# EAGLE design avt-trigger-shield (EAGLE 8.7.0)
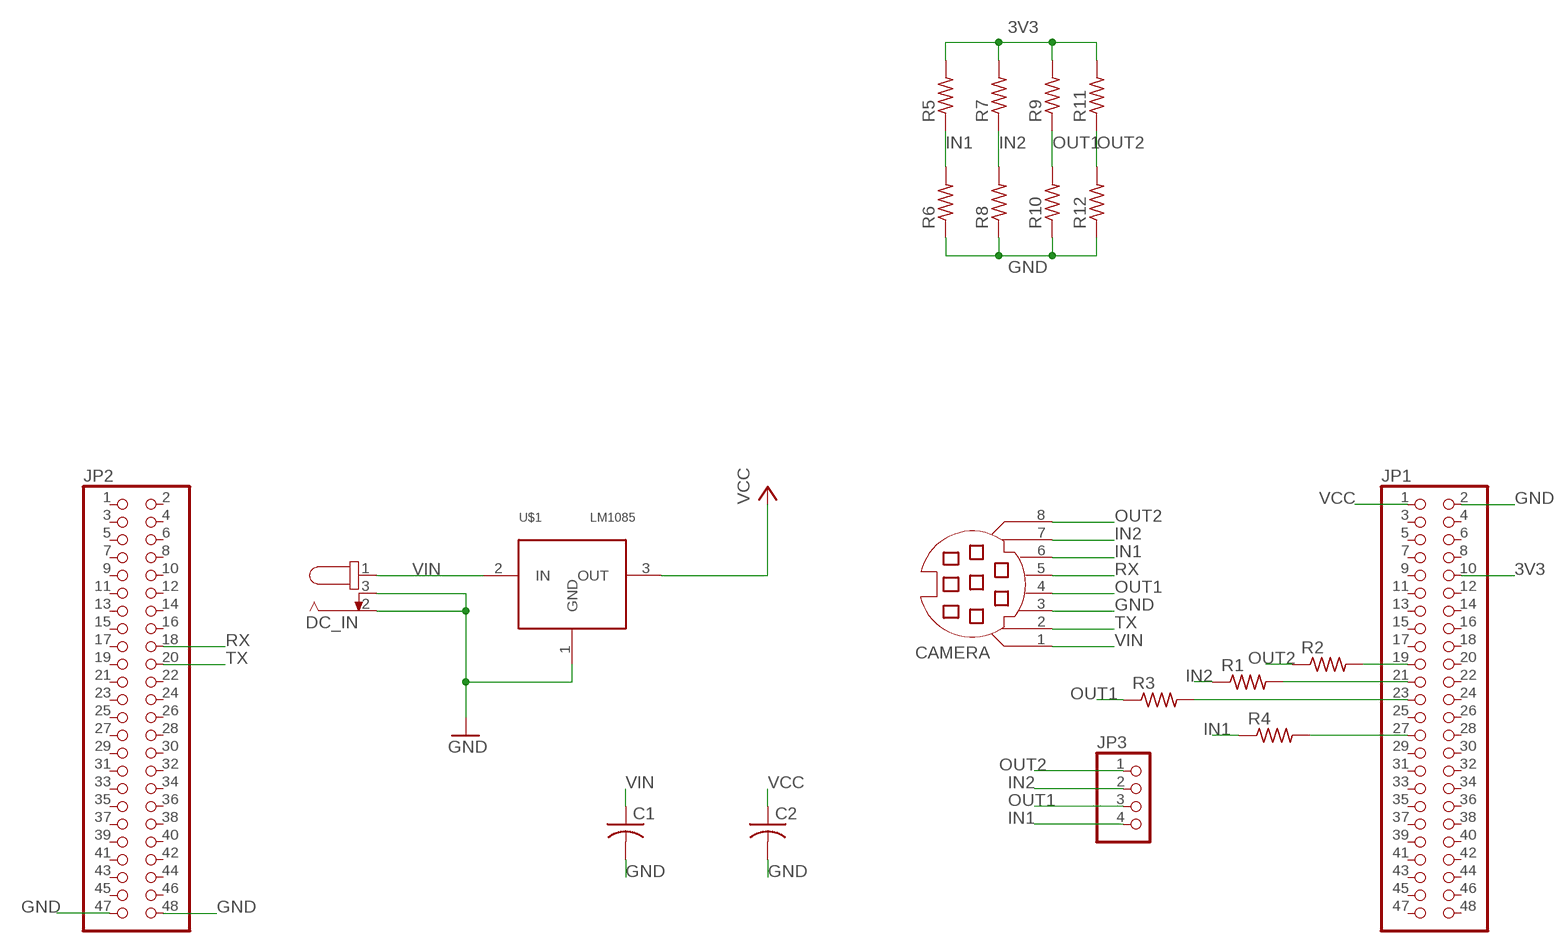
[diagram p0: schematic, sheet 1]

## Parts
C1  C-USC1206  [C1206]
C2  C-USC1206  [C1206]
CAMERA  MD08SS  [MDIN08SS]
DC_IN  694106105102  [694106105102]
JP1  PINHD-2X24  [2X24]
JP2  PINHD-2X24  [2X24]
JP3  PINHD-1X4  [1X04]
R1  R-US_R0603  [R0603]
R2  R-US_R0603  [R0603]
R3  R-US_R0603  [R0603]
R4  R-US_R0603  [R0603]
R5  R-US_R0603  [R0603]
R6  R-US_R0603  [R0603]
R7  R-US_R0603  [R0603]
R8  R-US_R0603  [R0603]
R9  R-US_R0603  [R0603]
R10  R-US_R0603  [R0603]
R11  R-US_R0603  [R0603]
R12  R-US_R0603  [R0603]
U$1  LM1085  [TO263]

## Nets
3V3: JP1.10 R5.2 R7.2 R9.2 R11.2
GND: C1.2 C2.2 CAMERA.3 DC_IN.2 DC_IN.3 JP1.2 JP2.47 JP2.48 R6.1 R8.1 R10.1 R12.1 U$1.1(GND)
IN1: CAMERA.6 JP3.4 R4.1 R5.1 R6.2
IN2: CAMERA.7 JP3.2 R1.1 R7.1 R8.2
N$1: JP1.21 R1.2
N$2: JP1.19 R2.2
N$3: JP1.23 R3.2
N$7: JP1.27 R4.2
OUT1: CAMERA.4 JP3.3 R3.1 R9.1 R10.2
OUT2: CAMERA.8 JP3.1 R2.1 R11.1 R12.2
RX: CAMERA.5 JP2.18
TX: CAMERA.2 JP2.20
VCC: C2.1 JP1.1 U$1.3(OUT)
VIN: C1.1 CAMERA.1 DC_IN.1 U$1.2(IN)
Unconnected: JP1.3 JP1.4 JP1.5 JP1.6 JP1.7 JP1.8 JP1.9 JP1.11 JP1.12 JP1.13 JP1.14 JP1.15 JP1.16 JP1.17 JP1.18 JP1.20 JP1.22 JP1.24 JP1.25 JP1.26 JP1.28 JP1.29 JP1.30 JP1.31 JP1.32 JP1.33 JP1.34 JP1.35 JP1.36 JP1.37 JP1.38 JP1.39 JP1.40 JP1.41 JP1.42 JP1.43 JP1.44 JP1.45 JP1.46 JP1.47 JP1.48 JP2.1 JP2.2 JP2.3 JP2.4 JP2.5 JP2.6 JP2.7 JP2.8 JP2.9 JP2.10 JP2.11 JP2.12 JP2.13 JP2.14 JP2.15 JP2.16 JP2.17 JP2.19 JP2.21 JP2.22 JP2.23 JP2.24 JP2.25 JP2.26 JP2.27 JP2.28 JP2.29 JP2.30 JP2.31 JP2.32 JP2.33 JP2.34 JP2.35 JP2.36 JP2.37 JP2.38 JP2.39 JP2.40 JP2.41 JP2.42 JP2.43 JP2.44 JP2.45 JP2.46

## Library data of the parts
C1 C2 = resistor:C-US: CAPACITOR, American symbol
CAMERA = con-yamaichi:MD08SS: YAMAICHI CONNECTOR; OC_FARNELL: unknown; OC_NEWARK: unknown
DC_IN = Wurth_Elektronik_Electromechanic_DC_Power_Jack_Connectors_rev15c:694106105102: WR-DC_DC Power Jack_Right Angled_SMT Center Pin Ø2.0_Plug ID Ø2.05_Plug OD Ø5.5_with Peg ;=>Code : Con_WR-DC_SMT_694106105102_694106105102 <http://katalog.we-online.de/media/images/eican/Con_WR-DC_SMT_694106105102_pf2.jpg> Details see: http://katalog.we-online.de/em/datasheet/6941xx105102.pdf Created 2014-10-08, Karrer Zheng 2014 (C) Wurth Elektronik
JP1 JP2 = pinhead:PINHD-2X24: PIN HEADER
JP3 = pinhead:PINHD-1X4: PIN HEADER
R1-R12 = rcl:R-US_: RESISTOR, American symbol; SPICEPREFIX: R
U$1 = custom-regs:LM1085

## Board
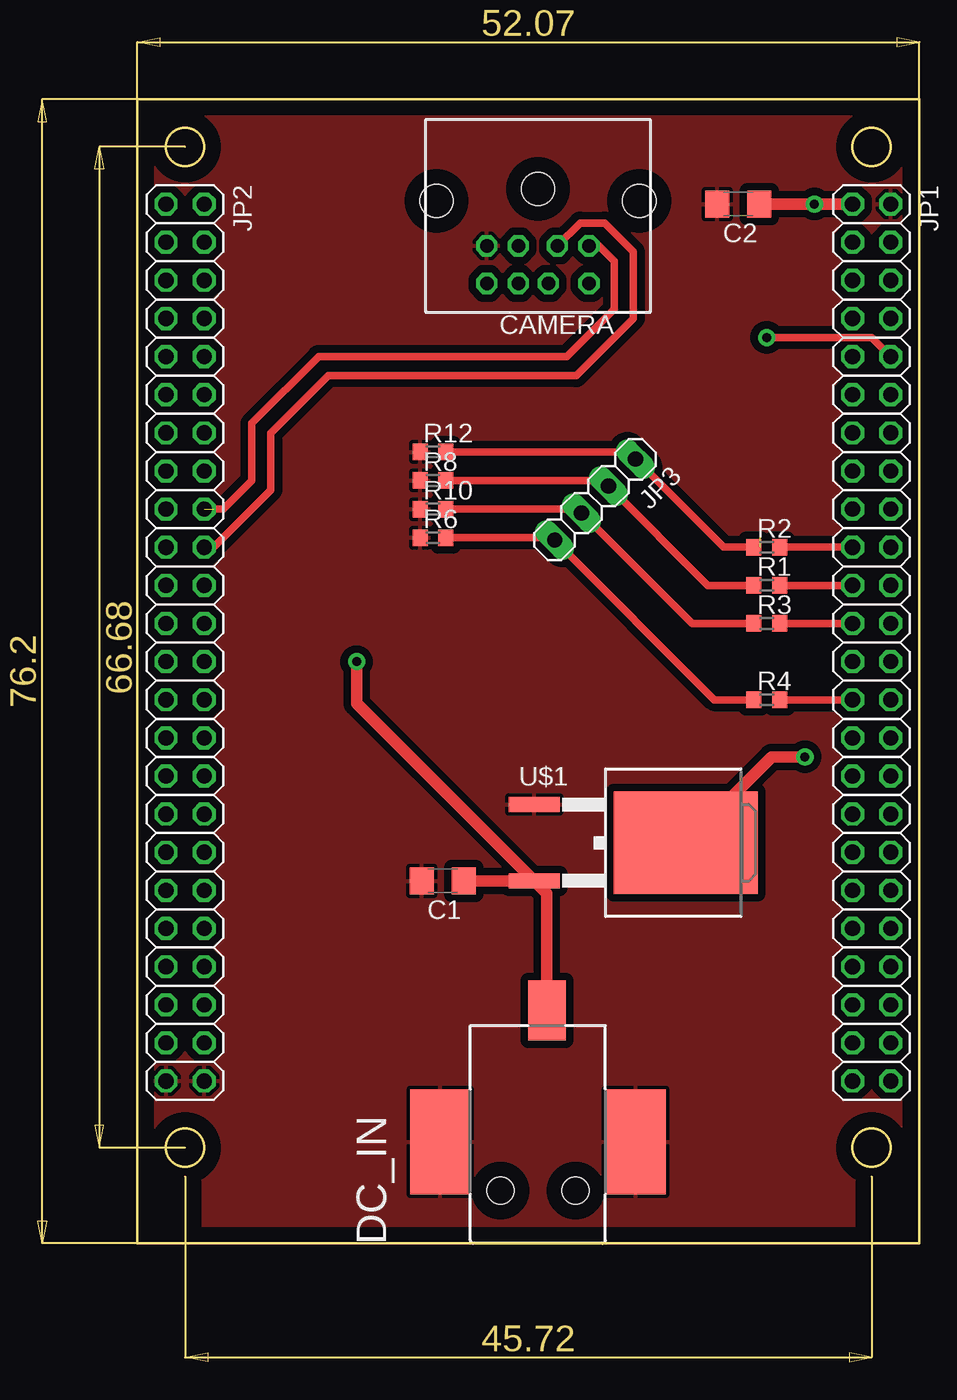
[diagram p1: board, top side]
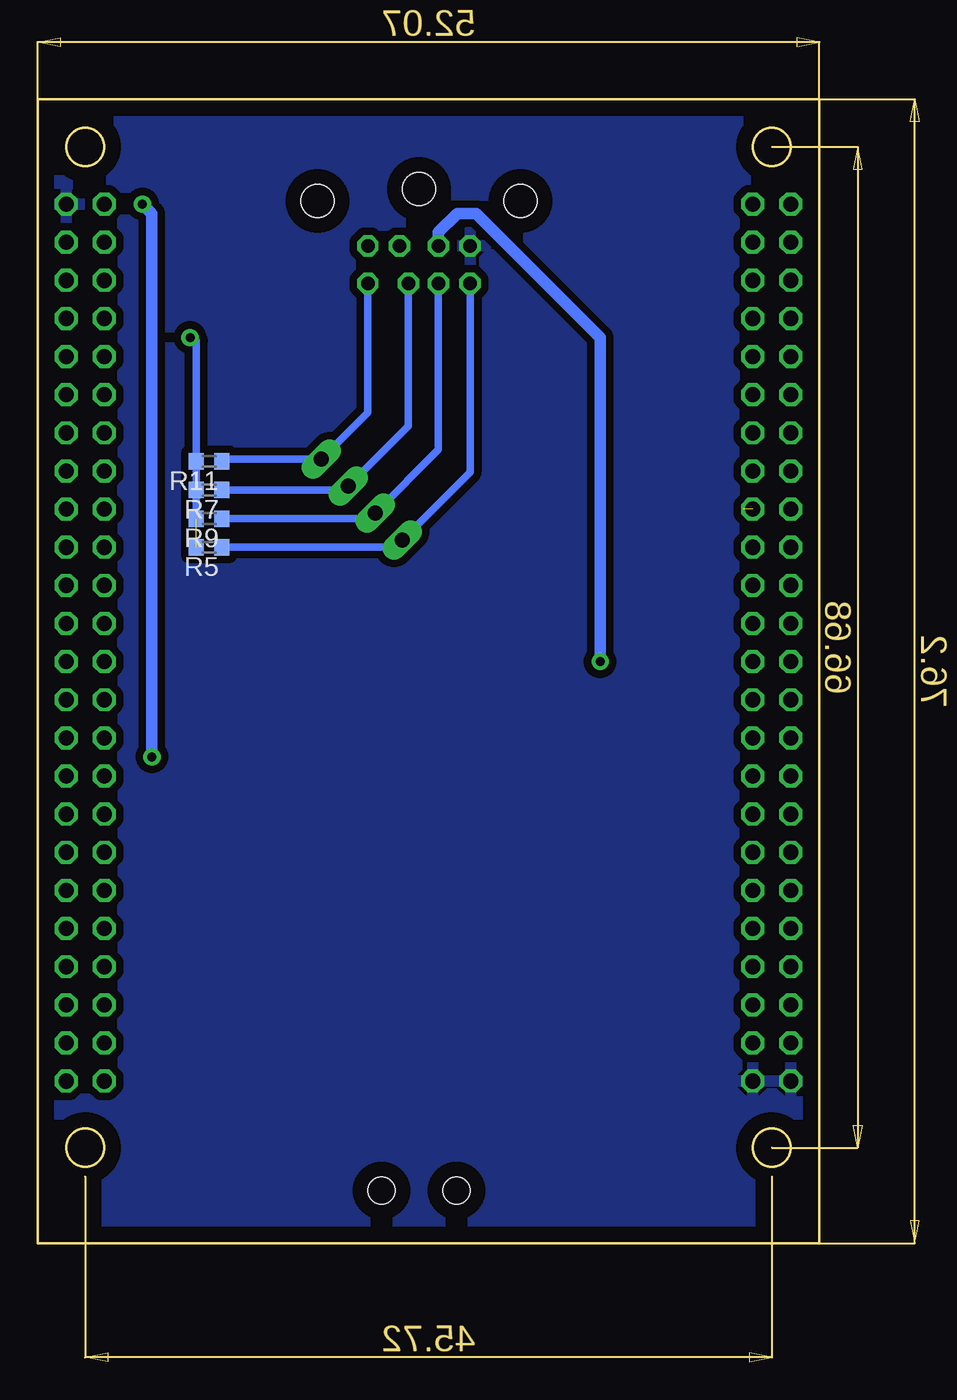
[diagram p2: board, bottom side, seen from below]

Size 52.07 x 76.2 mm. Coordinates in mm from the lower left corner, seen from the top.
Outline: 0,0 52.07,0 52.07,76.2 0,76.2 0,0
Outline: circle at 3.17,6.35 radius 1.27
Outline: circle at 3.17,73.03 radius 1.27
Outline: circle at 48.9,73.03 radius 1.27
Outline: circle at 48.9,6.35 radius 1.27
Copper layers (1*16): Top 0.035mm / dielectric 1.5mm / Bottom 0.035mm
Design rules "default": minimum track width 6mil, minimum drill 0.35mm, track to track 6mil, track to pad 6mil, pad to pad 6mil, via to via 6mil, smd to smd 6mil, copper to edge 40mil, drill to drill 6mil, minimum pad ring 10mil, minimum via ring 8mil, stop-mask expansion 4mil, vias tented up to drill 0mil, thermal gap 10mil

### Footprints (pad centres in the part's own frame; a part is rotated, then mirrored left to right if it is on the bottom)
C1206 = smd 1.6 x 1.8: 1 -1.4,0; 2 1.4,0
MDIN08SS = drill 0.9 octagon: 1 1.3,8.5; 2 -1.3,8.5; 3 3.4,8.5; 4 1.3,11; 5 -3.4,8.5; 6 3.4,11; 7 -0.7,11; 8 -3.4,11 | hole 2.2: -6.75,5.5; 0,4.7; 6.75,5.5
694106105102 = smd 4 x 2.5: 1 15.5,-0.6 | smd 7 x 4: 2 6.75,6.5; 3 6.75,-6.5 | hole 1.8: 3.5,2.5; 3.5,-2.5
2X24 = drill 1.016 octagon: 1 -27.94,-1.27; 2 -27.94,1.27; 3 -25.4,-1.27; 4 -25.4,1.27; 5 -22.86,-1.27; 6 -22.86,1.27; 7 -20.32,-1.27; 8 -20.32,1.27; 9 -17.78,-1.27; 10 -17.78,1.27; 11 -15.24,-1.27; 12 -15.24,1.27; 13 -12.7,-1.27; 14 -12.7,1.27; 15 -10.16,-1.27; 16 -10.16,1.27; 17 -7.62,-1.27; 18 -7.62,1.27; 19 -5.08,-1.27; 20 -5.08,1.27; 21 -2.54,-1.27; 22 -2.54,1.27; 23 0,-1.27; 24 0,1.27; 25 2.54,-1.27; 26 2.54,1.27; 27 5.08,-1.27; 28 5.08,1.27; 29 7.62,-1.27; 30 7.62,1.27; 31 10.16,-1.27; 32 10.16,1.27; 33 12.7,-1.27; 34 12.7,1.27; 35 15.24,-1.27; 36 15.24,1.27; 37 17.78,-1.27; 38 17.78,1.27; 39 20.32,-1.27; 40 20.32,1.27; 41 22.86,-1.27; 42 22.86,1.27; 43 25.4,-1.27; 44 25.4,1.27; 45 27.94,-1.27; 46 27.94,1.27; 47 30.48,-1.27; 48 30.48,1.27
1X04 = drill 1.016 long: 1 -3.81,0; 2 -1.27,0; 3 1.27,0; 4 3.81,0
R0603 = smd 1 x 1.1: 1 -0.85,0; 2 0.85,0
TO263 = smd 1 x 3.4: 1 -2.54,-6.6; 2 2.54,-6.6 | smd 6.8 x 9.6: 3 0,3.5

### Placement (x,y rotation side)
C1  20.32,24.13 180 top
C2  40.01,69.22 180 top
CAMERA  26.67,74.93 180 top
DC_IN  26.67,0 90 top
JP1  48.9,41.27 270 top
JP2  3.17,41.27 270 top
JP3  30.48,49.53 225 top
R1  41.91,43.81 0 top
R2  41.91,46.35 0 top
R3  41.91,41.27 0 top
R4  41.91,36.2 0 top
R5  40.64,46.35 180 bottom
R6  19.68,46.99 0 top
R7  40.64,50.16 180 bottom
R8  19.68,50.8 0 top
R9  40.64,48.26 180 bottom
R10  19.68,48.9 0 top
R11  40.64,52.07 180 bottom
R12  19.68,52.7 0 top
U$1  33.02,26.67 270 top

### Tracks (layer width: path | path; a pad name or v marks a point on that pad's centre or on a via)
3V3  (via drill 0.6 pad 1.15)  (1 unrouted)
  Top 0.508: JP1.10 48.9,60.33 v41.91,60.33
  Bottom 0.508: R7.2 R9.2 R11.2 41.49,60.11 v41.91,60.33
GND
  pour Top (isolate 0.508): 0,76.2 52.07,76.2 52.07,0 0,0
  pour Bottom (isolate 0.508): 0,76.2 52.07,76.2 52.07,0 0,0
IN1
  Top 0.508: R6.2 27.63,46.99 JP3.4 38.43,36.2 R4.1
  Bottom 0.508: R5.1 28.57,46.35 28.09,46.84 JP3.4 23.27,51.35 CAMERA.6
IN2
  Top 0.508: R1.1 37.99,43.81 JP3.2 31.01,50.8 R8.2
  Bottom 0.508: CAMERA.7 27.37,54.44 JP3.2 31.49,50.43 31.75,50.16 R7.1
N$1
  Top 0.508: R1.2 JP1.21
N$2
  Top 0.508: R2.2 JP1.19
N$3
  Top 0.508: R3.2 JP1.23
N$7
  Top 0.508: R4.2 JP1.27
OUT1
  Top 0.508: R3.1 36.94,41.27 JP3.3 29.32,48.9 R10.2
  Bottom 0.508: CAMERA.4 25.37,52.84 JP3.3 29.95,48.26 R9.1
OUT2
  Top 0.508: R12.2 32.69,52.7 JP3.1 39.04,46.35 R2.1
  Bottom 0.508: R11.1 39.64,52.22 JP3.1 30.07,55.33 CAMERA.8
RX  (1 unrouted)
  Top 0.508: CAMERA.5 30.73,66.43 31.75,65.41 31.75,62.23 28.57,59.05 12.06,59.05 7.62,54.61 7.62,50.8 5.71,48.9 5.08,48.9
TX
  Top 0.508: CAMERA.2 29.48,67.94 31.11,67.94 33.02,66.04 33.02,61.59 29.21,57.78 12.7,57.78 8.89,53.98 8.89,50.16 5.08,46.35 JP2.20
VCC  (via drill 0.6 pad 1.15)
  Top 0.762: U$1.3 42.23,32.38 v44.45,32.38 | JP1.1 v45.09,69.22 C2.1
  Bottom 0.762: v44.45,32.38 44.45,68.58 v45.09,69.22
VIN  (via drill 0.6 pad 1.15)
  Top 0.762: DC_IN.1 27.27,23.28 U$1.2 | U$1.2 C1.1 | U$1.2 14.61,35.95 v14.61,38.73
  Bottom 0.762: v14.61,38.73 14.61,60.33 22.86,68.58 24.13,68.58 25.37,67.34 CAMERA.1